# EAGLE design as5030 (EAGLE 5.04)
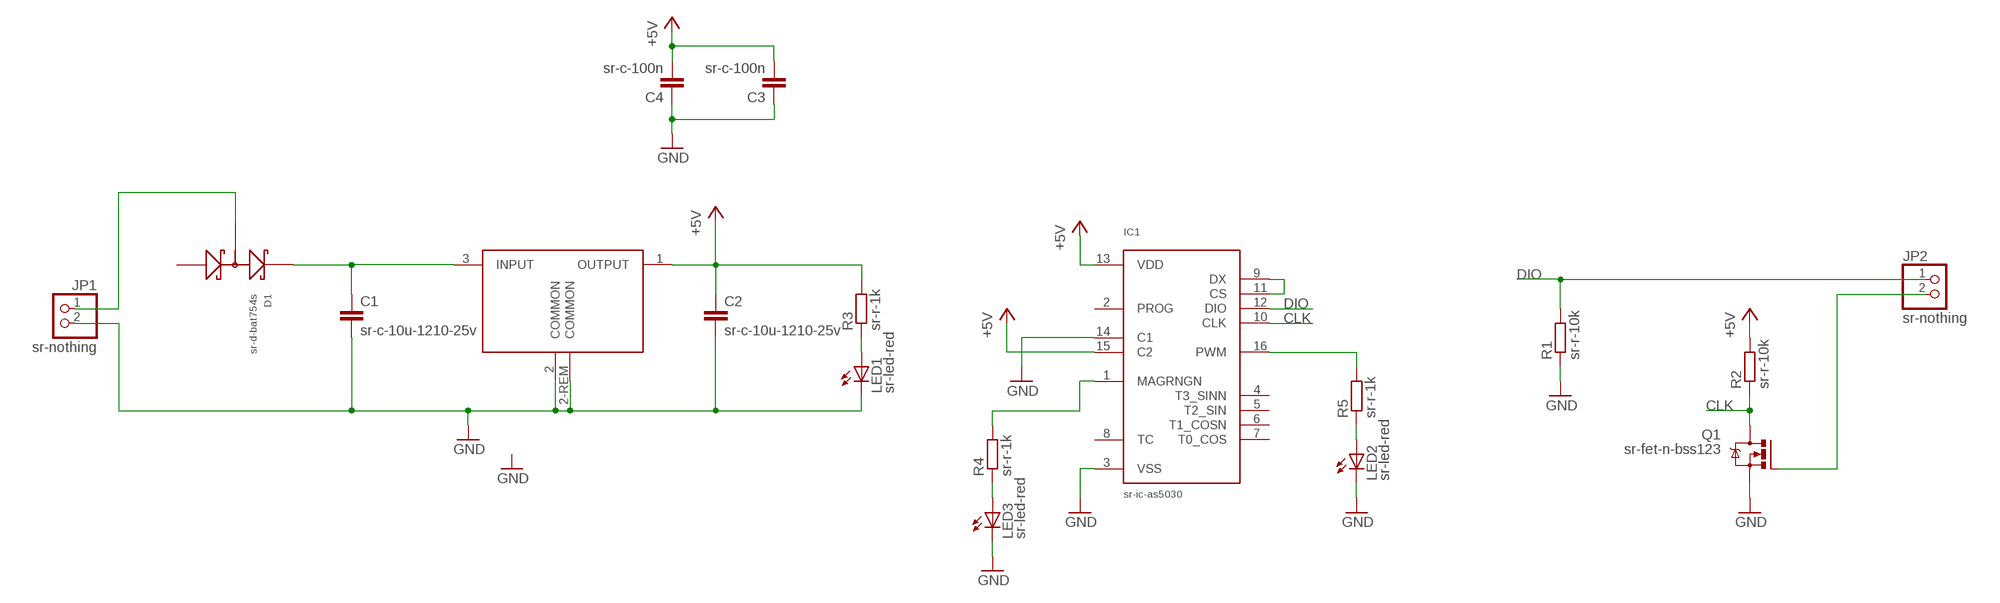
[diagram p0: schematic, sheet 1]

## Parts
C1  sr-c-10u-1210-25v  C-EUC1210  [C1210]
C2  sr-c-10u-1210-25v  C-EUC1210  [C1210]
C3  sr-c-100n  C-EUC0603  [C0603]
C4  sr-c-100n  C-EUC0603  [C0603]
D1  sr-d-bat754s  BAT754S  [SOT23]
IC1  sr-ic-as5030  AS5030ATST  [TSSOP16]
IC2  sr-ic-ua78l05  UA78L05  [SOT89-R]
JP1  sr-nothing  PINHD-1X2  [1X02]
JP2  sr-nothing  PINHD-1X2  [1X02]
LED1  sr-led-red  LEDCHIP-LED0603  [CHIP-LED0603]
LED2  sr-led-red  LEDCHIP-LED0603  [CHIP-LED0603]
LED3  sr-led-red  LEDCHIP-LED0603  [CHIP-LED0603]
Q1  sr-fet-n-bss123  2N7002  [SOT23]
R1  sr-r-10k  R-EU_R0603  [R0603]
R2  sr-r-10k  R-EU_R0603  [R0603]
R3  sr-r-1k  R-EU_R0603  [R0603]
R4  sr-r-1k  R-EU_R0603  [R0603]
R5  sr-r-1k  R-EU_R0603  [R0603]

## Nets
+5V: C2.1 C3.2 C4.2 IC1.13(VDD) IC1.15(C2) IC2.1(OUTPUT) R2.2 R3.2
CLK: IC1.10(CLK) Q1.3(D) R2.1
DIO: IC1.12(DIO) JP2.1 R1.2
GND: C1.2 C2.2 C3.1 C4.1 IC1.3(VSS) IC1.14(C1) IC2.2(COMMON) IC2.2-REM(COMMON) JP1.2 LED1.C LED2.C LED3.C Q1.2(S) R1.1
N$1: C1.1 D1.2(CATHODE) IC2.3(INPUT)
N$2: D1.3(MID) JP1.1
N$3: IC1.1(MAGRNGN) R4.2
N$4: LED1.A R3.1
N$5: JP2.2 Q1.1(G)
N$7: IC1.9(DX) IC1.11(CS)
N$8: LED3.A R4.1
N$9: IC1.16(PWM) R5.2
N$10: LED2.A R5.1
Unconnected: D1.1(ANODE) IC1.2(PROG) IC1.4(T3_SINN) IC1.5(T2_SIN) IC1.6(T1_COSN) IC1.7(T0_COS) IC1.8(TC)

## Library data of the parts
C1-C4 = rcl:C-EU: CAPACITOR, European symbol
D1 = ecssr:BAT754S
IC1 = ecssr:AS5030
IC2 = ecssr:UA78L05
JP1 JP2 = pinhead:PINHD-1X2: PIN HEADER
LED1-LED3 = led:LED: LED OSRAM: - CHIPLED LG R971, LG N971, LY N971, LG Q971, LY Q971, LO R971, LY R971 LH N974, LH R974 LS Q976, LO Q976, LY Q976 LO Q996 - Hyper CHIPLED LW Q18S LB Q993, LB Q99A, LB R99A - SideLED LS A670, LO A670, LY A670, LG A670, LP A670 LB A673, LV A673, LT A673, LW A673 LH A674 LY A675 LS A676, LA A676, LO A676, LY A676, LW A676 LS A679, LY A679, LG A679 - Hyper Micro SIDELED® LS Y876, LA Y876, LO Y876, LY Y876 LT Y87S - SmartLED LW L88C, LW L88S LB L89C, LB L89S, LG L890 LS L89K, LO L89K, LY L89K LS L896, LA L896, LO L896, LY L896 - TOPLED LS T670, LO T670, LY T670, LG T670, LP T670 LSG T670, LSP T670, LSY T670, LOP T670, LYG T670 LG T671, LOG T671, LSG T671 LB T673, LV T673, LT T673, LW T673 LH T674 LS T676, LA T676, LO T676, LY T676, LB T676, LH T676, LSB T676, LW T676 LB T67C, LV T67C, LT T67C, LS T67K, LO T67K, LY T67K, LW E67C LS E67B, LA E67B, LO E67B, LY E67B, LB E67C, LV E67C, LT E67C LW T67C LS T679, LY T679, LG T679 LS T770, LO T770, LY T770, LG T770, LP T770 LB T773, LV T773, LT T773, LW T773 LH T774 LS E675, LA E675, LY E675, LS T675 LS T776, LA T776, LO T776, LY T776, LB T776 LHGB T686 LT T68C, LB T68C - Hyper Mini TOPLED® LB M676 - Mini TOPLED Santana® LG M470 LS M47K, LO M47K, LY M47K Source: http://www.osram.convergy.de LUXEON: - LUMILED® LXK2-PW12-R00, LXK2-PW12-S00, LXK2-PW14-U00, LXK2-PW14-V00 LXK2-PM12-R00, LXK2-PM12-S00, LXK2-PM14-U00 LXK2-PE12-Q00, LXK2-PE12-R00, LXK2-PE12-S00, LXK2-PE14-T00, LXK2-PE14-U00 LXK2-PB12-K00, LXK2-PB12-L00, LXK2-PB12-M00, LXK2-PB14-N00, LXK2-PB14-P00, LXK2-PB14-Q00 LXK2-PR12-L00, LXK2-PR12-M00, LXK2-PR14-Q00, LXK2-PR14-R00 LXK2-PD12-Q00, LXK2-PD12-R00, LXK2-PD12-S00 LXK2-PH12-R00, LXK2-PH12-S00 LXK2-PL12-P00, LXK2-PL12-Q00, LXK2-PL12-R00 Source: www.luxeon.com KINGBRIGHT: KA-3528ASYC Source: www.kingbright.com
Q1 = ecssr:2N7002
R1-R5 = rcl:R-EU_: RESISTOR, European symbol

## Board
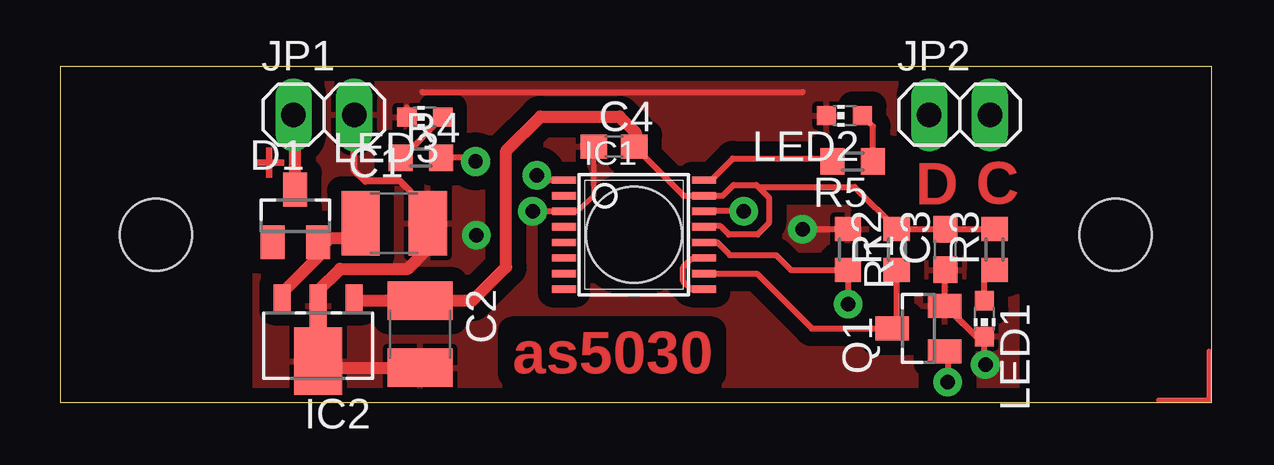
[diagram p1: board, top side]
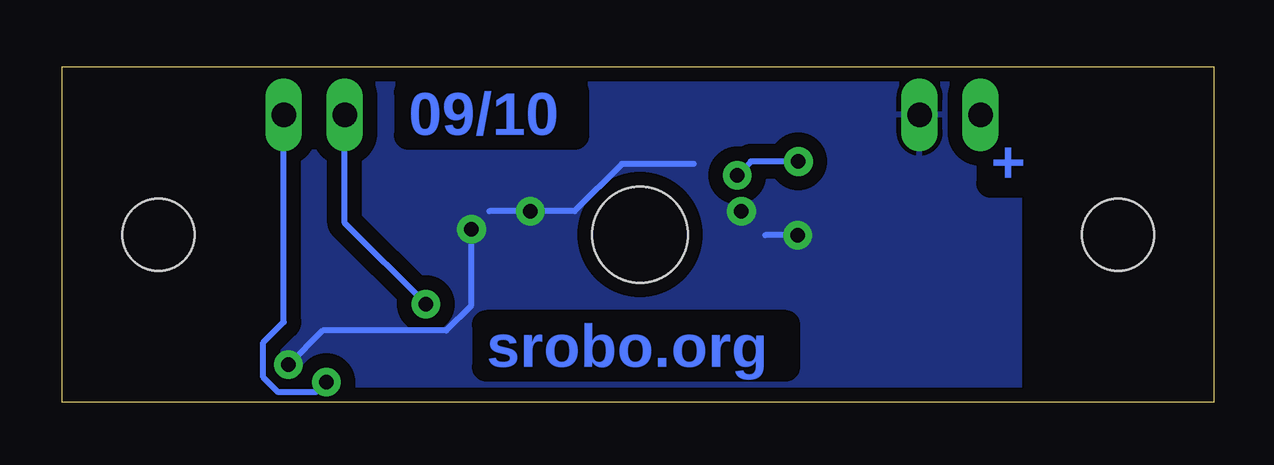
[diagram p2: board, bottom side, seen from below]

Size 48 x 14 mm. Coordinates in mm from the lower left corner, seen from the top.
Outline: 0,0 48,0 48,14 0,14 0,0
Copper layers (1*16): Top 0.035mm / dielectric 1.5mm / Bottom 0.035mm
Design rules "default": minimum track width 0.2mm, minimum drill 0.5mm, track to track 0.2mm, track to pad 0.2mm, pad to pad 0.2mm, via to via 0.2mm, smd to smd 0mil, copper to edge 0.2mm, drill to drill 0.2mm, minimum pad ring 0.2mm, minimum via ring 0.2mm, stop-mask expansion 0mil, vias tented up to drill 0mil, thermal gap 0.2mm
Holes 3 mm at 4,7 44,7
Holes 4 mm at 23.93,7
tKeepout: area 0,0 to 8,14; area 40,0 to 48,14

### Footprints (pad centres in the part's own frame; a part is rotated, then mirrored left to right if it is on the bottom)
C1210 = smd 1.6 x 2.7: 1 -1.4,0; 2 1.4,0
C0603 = smd 1.1 x 1: 1 -0.85,0; 2 0.85,0
SOT23 = smd 1 x 1.4: 1 -0.95,-1.1; 2 0.95,-1.1; 3 0,1.1
TSSOP16 = smd 0.305 x 0.991: 1 -2.275,-2.918; 2 -1.625,-2.918; 3 -0.975,-2.918; 4 -0.325,-2.918; 5 0.325,-2.918; 6 0.975,-2.918; 7 1.625,-2.918; 8 2.275,-2.918; 9 2.275,2.918; 10 1.625,2.918; 11 0.975,2.918; 12 0.325,2.918; 13 -0.325,2.918; 14 -0.975,2.918; 15 -1.625,2.918; 16 -2.275,2.918
SOT89-R = smd 0.7 x 1.1: 1 -1.5,-1.75; 3 1.5,-1.75 | smd 0.7 x 1.8: 2 0,-1.4 | smd 2 x 2.8: 2-REM 0,0.9
1X02 = drill 1.016 long: 1 -1.27,0; 2 1.27,0
CHIP-LED0603 = smd 0.8 x 0.8: A 0,-0.75; C 0,0.75
R0603 = smd 1 x 1.1: 1 -0.85,0; 2 0.85,0

### Placement (x,y rotation side)
C1  13.93,7.47 0 top
C2  15.02,2.85 270 top
C3  36.91,6.38 90 top
C4  23.09,10.66 0 top
D1  9.81,7.78 0 top
IC1  23.93,7 270 top
IC2  10.77,2.62 180 top
JP1  11,12 0 top
JP2  37.5,12 0 top
LED1  38.53,3.5 180 top
LED2  32.7,11.96 90 top
LED3  15.21,11.9 90 top
Q1  35.78,3.08 90 top
R1  32.84,6.38 270 top
R2  34.88,6.38 90 top
R3  38.95,6.38 90 top
R4  15.04,10.21 0 top
R5  33.05,10.05 180 top

### Tracks (layer width: path | path; a pad name or v marks a point on that pad's centre or on a via)
+5V
  Top 0.25: C4.2 23.98,10.66 | C4.2 25.98,8.62 IC1.15 27.62,8.62 28.07,9.07 29.02,9.07 29.11,8.99 | IC1.13 26.87,7.35 27.52,7.35 27.88,7 29.07,7 29.55,7.47 29.55,8.55 29.11,8.99 | 24,10.72 C4.2 | R3.2 C3.2 R2.2 33.12,8.99 29.11,8.99 | IC2.1 12.39,4.25
  Top 0.5: 24,10.72 24,11.25 23.32,11.93 20.02,11.93 18.6,10.5 18.6,5.65 17.2,4.25 C2.1 12.39,4.25
CLK
  Top 0.25: R2.1 34.88,3.51 Q1.3 31.34,3.08 29.05,5.38 IC1.10
DIO  (via drill 0.6 pad 1.2)
  Top 0.25: IC1.12 27.4,6.67 27.93,6.15 29.85,6.15 30.48,5.53 R1.2 v32.85,4.1
  Bottom 0.25: JP2.1 36.23,7.48 v32.85,4.1
GND  (via drill 0.6 pad 1.2)
  Top 0.2: C4.1 22.25,8.65 21.57,7.97 IC1.3
  Top 0.25: C2.2 14.84,1.45 | C1.2 15.56,6.97 | JP1.2 12.45,11.44 12.28,11.61 JP1.2 | C4.1 | 10.77,4.67 IC2.2 IC2.2-REM 11.04,1.45 | 15.18,6.45 15.18,7.07 C1.2 | C3.1 36.88,5.5 | Q1.2 38.42,2.5 LED1.C 38.53,1.61 v38.58,1.57 | v19.7,7.97 IC1.3 | v28.5,7.97 IC1.14 | C3.1 36.91,5.08 36.88,5.05 | 38.42,2.52 36.92,4.03 36.88,4.03 36.88,5.5 arc-90 C3.1 | v30.95,7.22 R1.1 | 14.95,6.95 15.01,6.95 C1.2 | 15.1,12.95 30.96,12.95 | LED3.C 14.46,12.3 | 15.07,8.32 15.07,7.72 C1.2
  Top 0.3: 15.07,8.32 14.18,9.22 12.72,9.22 12.27,9.68 JP1.2
  Top 0.5: 11.04,1.45 C2.2 | 10.77,4.67 11.68,5.58 14.5,5.58 15.33,6.41 C1.2
  Bottom 0.25: 21.68,9.95 24.68,9.95 26.65,7.97 v28.5,7.97 30.2,7.97 | v38.58,1.57 37.15,3 32,3 30.95,4.05 v30.95,7.22 | v17.35,6.97 18.7,6.97
  pour Top (isolate 0.6): 8.12,14.18 8.12,-1.18 37.75,-1.18 39.88,-1.18 39.88,14.68 8.12,14.68
  pour Bottom (isolate 0.6): 8.53,14.43 8.12,14.43 8.12,13.4 8.12,-1.32 13.18,-1.32 39.88,-1.32 39.88,14.57 8.53,14.57
N$1
  Top 0.25: 10.74,6.33 D1.2 10.76,6.06 | IC2.3 9.27,4.57 | 12.36,6.33 12.62,6.6 12.62,6.85 12.62,7.22 C1.1
  Top 0.5: 9.27,4.57 10.76,6.06 | 10.74,6.33 11.26,6.85 12.62,6.85
N$2
  Top 0.25: 9.81,11.92 JP1.1
  Top 0.5: D1.3 9.81,11.92
N$3  (via drill 0.6 pad 1.2)
  Top 0.25: IC1.1 20.07,9.28 v19.88,9.47 | 17.3,10.03 v17.32,10.05 arc90 17.17,10.21 R4.2
  Bottom 0.25: v19.88,9.47 19.3,10.05 v17.32,10.05
N$4
  Top 0.25: R3.1 38.53,5.53 LED1.A
N$5  (via drill 0.6 pad 1.2)
  Top 0.25: Q1.1 36.59,1.85 37,1.85 | 37,1.85 37,2.1 | 37,1.85 v37,0.85
  Bottom 0.25: v37,0.85 37.42,0.42 39,0.42 39.62,1.05 39.62,2.5 38.77,3.35 JP2.2
N$7
  Top 0.2: IC1.11 26.79,5.97 26.3,5.97
  Top 0.25: 26.3,5.97 25.98,5.65 25.98,5.05 26.3,4.72 IC1.9
N$8
  Top 0.25: LED3.A 14.19,10.14 R4.1
N$9
  Top 0.25: R5.2 32.3,10.18 28.05,10.18 27.15,9.28 IC1.16
N$10
  Top 0.25: LED2.A 33.9,11.52 R5.1
N$11
  Top 0.2: 45.8,0.1 47.9,0.1 47.9,2.15

### Text on the board
Top: + | D | C | as5030
Bottom: 09/10 | + | srobo.org